# EAGLE schematic Project_02 (EAGLE 9.6.2)
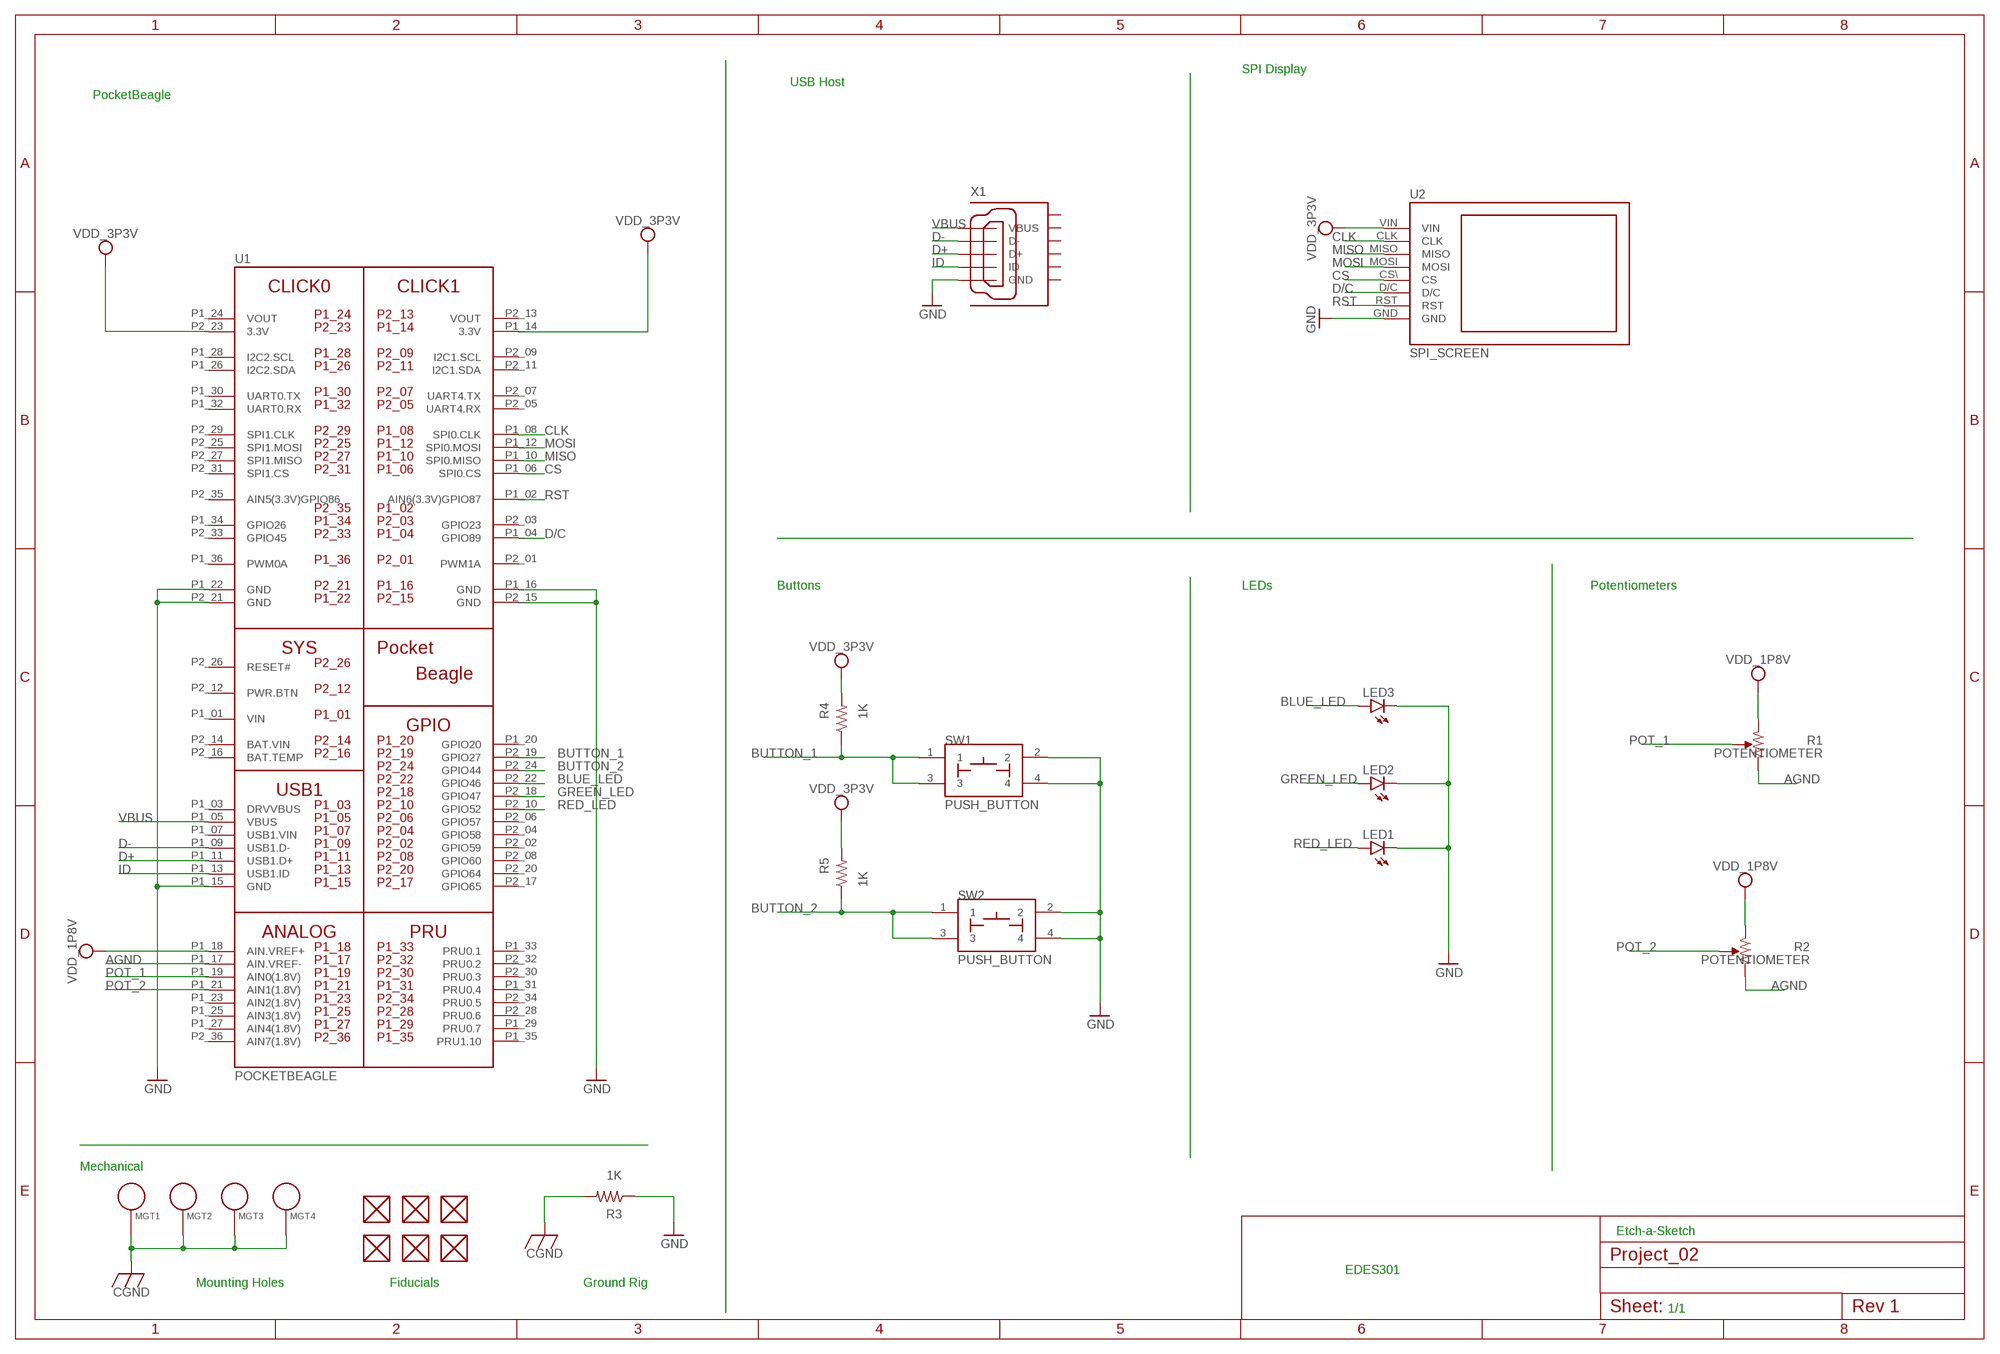
[diagram p0: schematic, sheet 1]

## Parts
FUD1  FIDUCIAL  [FIDUCIAL_40MIL]
FUD2  FIDUCIAL  [FIDUCIAL_40MIL]
FUD3  FIDUCIAL  [FIDUCIAL_40MIL]
FUD4  FIDUCIAL  [FIDUCIAL_40MIL]
FUD5  FIDUCIAL  [FIDUCIAL_40MIL]
FUD6  FIDUCIAL  [FIDUCIAL_40MIL]
LED1  LED-(INCH)-0603  [0603-LED]
LED2  LED-(INCH)-0603  [0603-LED]
LED3  LED-(INCH)-0603  [0603-LED]
MGT1  MOUNTING_HOLE  [MOUNTING_HOLE]
MGT2  MOUNTING_HOLE  [MOUNTING_HOLE]
MGT3  MOUNTING_HOLE  [MOUNTING_HOLE]
MGT4  MOUNTING_HOLE  [MOUNTING_HOLE]
R1  POTENTIOMETER  [POT-PO90S]
R2  POTENTIOMETER  [POT-PO90S]
R3  1K  R_R0603  [R0603]
R4  1K  R_R0603  [R0603]
R5  1K  R_R0603  [R0603]
SW1  PUSH_BUTTON  [BUTTON_12.5MM]
SW2  PUSH_BUTTON  [BUTTON_12.5MM]
U1  POCKETBEAGLE  [POCKETBEAGLE]
U2  SPI_SCREEN  [ADAFRUIT-2.8-TFT-SPI-SCREEN]
X1  10118192-0001LF  [10118192-0001LF(MICRO-USB-B-AMPHENOL-FCI)]

## Nets
AGND: R1.CW R2.CW U1.P1_17(AIN.VREF-)
BLUE_LED: LED3.A U1.P2_22(GPIO46)
BUTTON_1: R4.1 SW1.1 SW1.3 U1.P2_19(GPIO27)
BUTTON_2: R5.1 SW2.1 SW2.3 U1.P2_24(GPIO44)
CGND: MGT1.P$1 MGT2.P$1 MGT3.P$1 MGT4.P$1 R3.2
CLK: U1.P1_08(SPI0.CLK) U2.CLK
CS: U1.P1_06(SPI0.CS) U2.CS\(CS)
D+: U1.P1_11(USB1.D+) X1.D+
D-: U1.P1_09(USB1.D-) X1.D-
D/C: U1.P1_04(GPIO89) U2.D/C
GND: LED1.K LED2.K LED3.K R3.1 SW1.2 SW1.4 SW2.2 SW2.4 U1.P1_15(GND) U1.P1_16(GND) U1.P1_22(GND) U1.P2_15(GND) U1.P2_21(GND) U2.GND X1.GND
GREEN_LED: LED2.A U1.P2_18(GPIO47)
ID: U1.P1_13(USB1.ID) X1.ID
MISO: U1.P1_10(SPI0.MISO) U2.MISO
MOSI: U1.P1_12(SPI0.MOSI) U2.MOSI
POT_1: R1.S U1.P1_19(AIN0(1.8V))
POT_2: R2.S U1.P1_21(AIN1(1.8V))
RED_LED: LED1.A U1.P2_10(GPIO52)
RST: U1.P1_02(AIN6(3.3V)GPIO87) U2.RST
VBUS: U1.P1_05(VBUS) X1.VBUS
VDD_1P8V: R1.CCW R2.CCW U1.P1_18(AIN.VREF+)
VDD_3P3V: R4.2 R5.2 U1.P1_14(3.3V) U1.P2_23(3.3V) U2.VIN
Unconnected: FUD1.P$1 FUD2.P$1 FUD3.P$1 FUD4.P$1 FUD5.P$1 FUD6.P$1 U1.P1_03(DRVVBUS) U1.P1_07(USB1.VIN) U1.P1_20(GPIO20) U1.P1_23(AIN2(1.8V)) U1.P1_25(AIN3(1.8V)) U1.P1_26(I2C2.SDA) U1.P1_27(AIN4(1.8V)) U1.P1_28(I2C2.SCL) U1.P1_29(PRU0.7) U1.P1_30(UART0.TX) U1.P1_31(PRU0.4) U1.P1_32(UART0.RX) U1.P1_33(PRU0.1) U1.P1_34(GPIO26) U1.P1_35(PRU1.10) U1.P1_36(PWM0A) U1.P2_01(PWM1A) U1.P2_02(GPIO59) U1.P2_03(GPIO23) U1.P2_04(GPIO58) U1.P2_05(UART4.RX) U1.P2_06(GPIO57) U1.P2_07(UART4.TX) U1.P2_08(GPIO60) U1.P2_09(I2C1.SCL) U1.P2_11(I2C1.SDA) U1.P2_12(PWR.BTN) U1.P2_16(BAT.TEMP) U1.P2_17(GPIO65) U1.P2_20(GPIO64) U1.P2_25(SPI1.MOSI) U1.P2_26(RESET#) U1.P2_27(SPI1.MISO) U1.P2_28(PRU0.6) U1.P2_29(SPI1.CLK) U1.P2_30(PRU0.3) U1.P2_31(SPI1.CS) U1.P2_32(PRU0.2) U1.P2_33(GPIO45) U1.P2_34(PRU0.5) U1.P2_35(AIN5(3.3V)GPIO86) U1.P2_36(AIN7(1.8V)) X1.CGND1(SGND1) X1.CGND2(SGND2) X1.CGND3(SGND3) X1.CGND4(SGND4) X1.CGND5(SGND5) X1.CGND6(SGND6)

## Notes on the sheet
- SPI Display
- USB Host
- PocketBeagle
- Buttons | LEDs | Potentiometers
- Mechanical
- Etch-a-Sketch
- EDES301
- Mounting Holes | Fiducials | Ground Rig
- 1/1

## Power pins joined to a net without a drawn wire
BAT.VIN: U1.P2_14(BAT.VIN)
VIN: U1.P1_01(VIN)
VOUT: U1.P1_24(VOUT) U1.P2_13(VOUT)

## Library data of the parts
FUD1-FUD6 = Project_02:FIDUCIAL
LED1-LED3 = Project_02:LED-(INCH)-: Basic SMD LEDs
MGT1-MGT4 = Project_02:MOUNTING_HOLE: Chassis Mounting Hole w/GND connection ability
R1 R2 = Project_02:POTENTIOMETER: Potentiometer - Examples: P090S-14T20BR10K (987-1277-ND)
R3-R5 = Project_02:R_: RESISTOR, American symbol
SW1 SW2 = Project_02:PUSH_BUTTON
U1 = Project_02:POCKETBEAGLE
U2 = Project_02:SPI_SCREEN
X1 = Project_02:10118192-0001LF: Amphenol FCI Micro USB Type B Complete Surface Mount (SMT) no guide holes